# EAGLE design QREx16 (EAGLE 9.4.2)
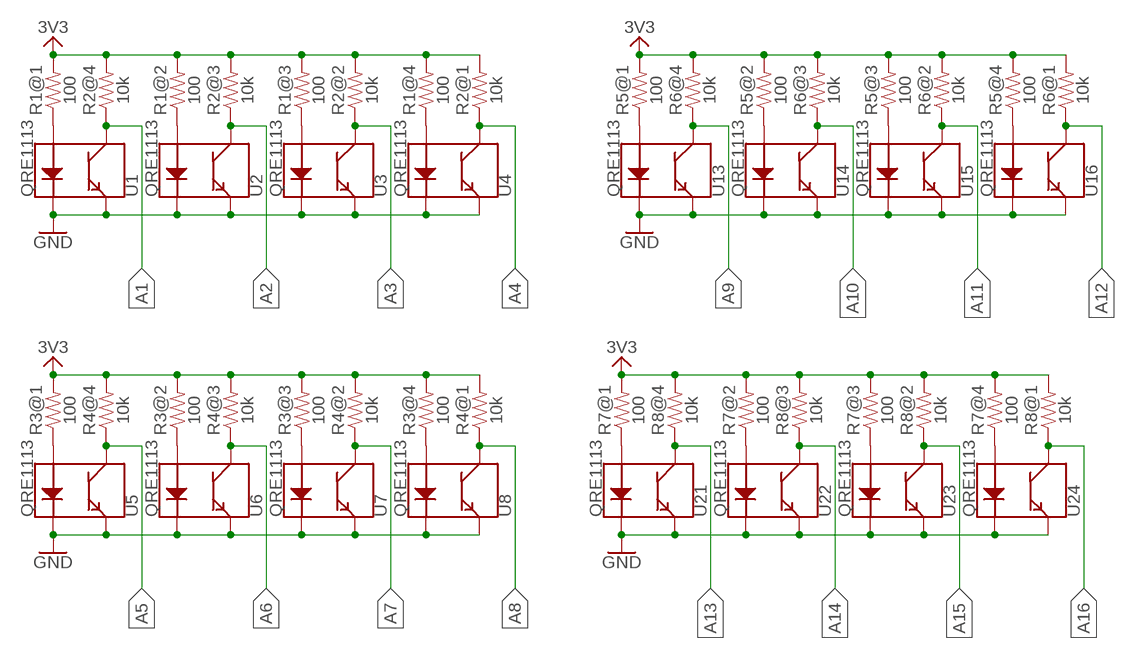
[diagram p0: schematic, sheet 1]

## Parts
R1  100  RESISTOR_ARRAY_1206_SEPARATE  [RESCAF80P320X160X60-8N]
R2  10k  RESISTOR_ARRAY_1206_SEPARATE  [RESCAF80P320X160X60-8N]
R3  100  RESISTOR_ARRAY_1206_SEPARATE  [RESCAF80P320X160X60-8N]
R4  10k  RESISTOR_ARRAY_1206_SEPARATE  [RESCAF80P320X160X60-8N]
R5  100  RESISTOR_ARRAY_1206_SEPARATE  [RESCAF80P320X160X60-8N]
R6  10k  RESISTOR_ARRAY_1206_SEPARATE  [RESCAF80P320X160X60-8N]
R7  100  RESISTOR_ARRAY_1206_SEPARATE  [RESCAF80P320X160X60-8N]
R8  10k  RESISTOR_ARRAY_1206_SEPARATE  [RESCAF80P320X160X60-8N]
U1  QRE1113  QRE1113SMD-W  [QRE1113-W]
U2  QRE1113  QRE1113SMD-W  [QRE1113-W]
U3  QRE1113  QRE1113SMD-W  [QRE1113-W]
U4  QRE1113  QRE1113SMD-W  [QRE1113-W]
U5  QRE1113  QRE1113SMD-W  [QRE1113-W]
U6  QRE1113  QRE1113SMD-W  [QRE1113-W]
U7  QRE1113  QRE1113SMD-W  [QRE1113-W]
U8  QRE1113  QRE1113SMD-W  [QRE1113-W]
U13  QRE1113  QRE1113SMD-W  [QRE1113-W]
U14  QRE1113  QRE1113SMD-W  [QRE1113-W]
U15  QRE1113  QRE1113SMD-W  [QRE1113-W]
U16  QRE1113  QRE1113SMD-W  [QRE1113-W]
U21  QRE1113  QRE1113SMD-W  [QRE1113-W]
U22  QRE1113  QRE1113SMD-W  [QRE1113-W]
U23  QRE1113  QRE1113SMD-W  [QRE1113-W]
U24  QRE1113  QRE1113SMD-W  [QRE1113-W]

## Nets
3.3V: R1.5 R1.6 R1.7 R1.8 R2.5 R2.6 R2.7 R2.8 R3.5 R3.6 R3.7 R3.8 R4.5 R4.6 R4.7 R4.8 R5.5 R5.6 R5.7 R5.8 R6.5 R6.6 R6.7 R6.8 R7.5 R7.6 R7.7 R7.8 R8.5 R8.6 R8.7 R8.8 ; supply symbol labelled SUPPLY_3.3V
A1: R2.4 U1.3(C)
A2: R2.3 U2.3(C)
A3: R2.2 U3.3(C)
A4: R2.1 U4.3(C)
A5: R4.4 U5.3(C)
A6: R4.3 U6.3(C)
A7: R4.2 U7.3(C)
A8: R4.1 U8.3(C)
A9: R6.4 U13.3(C)
A10: R6.3 U14.3(C)
A11: R6.2 U15.3(C)
A12: R6.1 U16.3(C)
A13: R8.4 U21.3(C)
A14: R8.3 U22.3(C)
A15: R8.2 U23.3(C)
A16: R8.1 U24.3(C)
GND: U1.2(K) U1.4(E) U2.2(K) U2.4(E) U3.2(K) U3.4(E) U4.2(K) U4.4(E) U5.2(K) U5.4(E) U6.2(K) U6.4(E) U7.2(K) U7.4(E) U8.2(K) U8.4(E) U13.2(K) U13.4(E) U14.2(K) U14.4(E) U15.2(K) U15.4(E) U16.2(K) U16.4(E) U21.2(K) U21.4(E) U22.2(K) U22.4(E) U23.2(K) U23.4(E) U24.2(K) U24.4(E) ; supply symbol labelled SUPPLY_GND
N$5: R1.1 U1.1(A)
N$6: R1.2 U2.1(A)
N$7: R1.3 U3.1(A)
N$8: R1.4 U4.1(A)
N$9: R3.1 U5.1(A)
N$10: R3.2 U6.1(A)
N$11: R3.3 U7.1(A)
N$12: R3.4 U8.1(A)
N$13: R5.1 U13.1(A)
N$14: R5.2 U14.1(A)
N$15: R5.3 U15.1(A)
N$16: R5.4 U16.1(A)
N$21: R7.1 U21.1(A)
N$22: R7.2 U22.1(A)
N$23: R7.3 U23.1(A)
N$24: R7.4 U24.1(A)

## Library data of the parts
R1-R8 = Scott-Electrical:RESISTOR_ARRAY_1206_SEPARATE
U1-U8 U13-U16 U21-U24 = Scott-Sensors:QRE1113: QRE1113 Reflective Object Sensor The QRE1113 is a small IR reflectance sensor. This sensor is often used in line following robots because, if it can sense if a surface is white or black. There are four pins on the QRE1113 - two control the IR emitting LED while the other two are the collector and emitter of a phototransistor. The IR diode has a max forward current of 50mA and operates at 940nm. Datasheet <http://www.sparkfun.com/datasheets/Components/SMD/QRE1113.GR.pdf> SparkFun Products IR Reflectance Sensor - QRE1113 <https://www.sparkfun.com/products/9542> (COM-09542) SparkFun Line Sensor Breakout - QRE1113 (Analog) <https://www.sparkfun.com/products/9453> (ROB-09453) SparkFun Line Sensor Breakout - QRE1113 (Digital) <https://www.sparkfun.com/products/9454> (ROB-09454) SparkFun RedBot Sensor - Line Follower <https://www.sparkfun.com/products/11769> (SEN-11769) SparkFun RedBot Sensor - Wheel Encoder <https://www.sparkfun.com/products/12617> (SEN-12617) SparkFun Line Follower Array <https://www.sparkfun.com/products/13582> (SEN-13582); PROD_ID: IC-09357; SF_ID: COM-09542

## Board
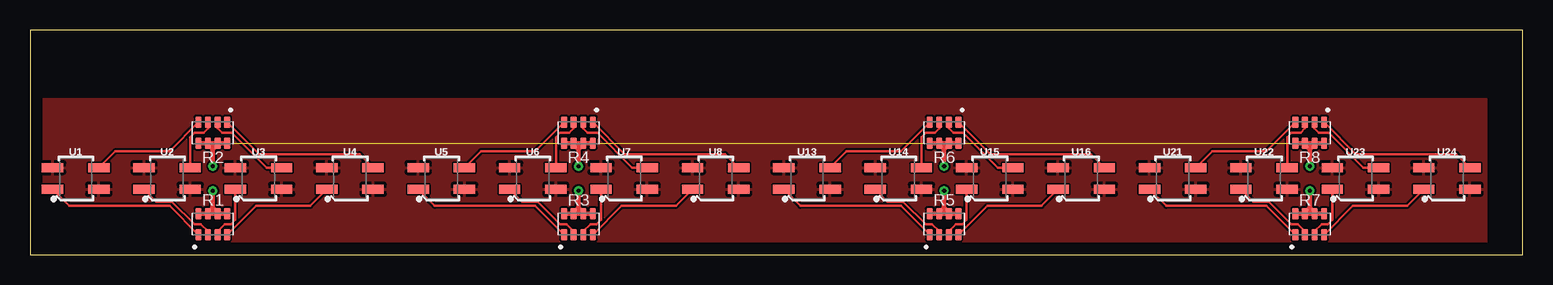
[diagram p1: board, top side]
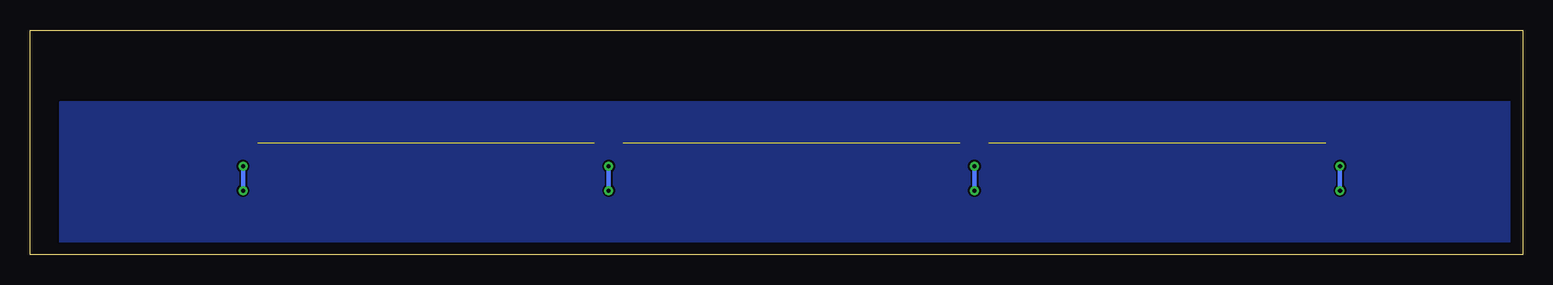
[diagram p2: board, bottom side, seen from below]

Size 124.44 x 18.72 mm. Coordinates in mm from the lower left corner, seen from the top.
Outline: 0,0 124.44,0 124.44,18.72 0,18.72 0,0
Copper layers (1*16): Top 0.035mm / dielectric 0.15mm / Bottom 0.035mm
Design rules "default": minimum track width 6mil, minimum drill 0.35mm, track to track 6mil, track to pad 6mil, pad to pad 6mil, via to via 6mil, smd to smd 6mil, copper to edge 40mil, drill to drill 6mil, minimum pad ring 10mil, minimum via ring 8mil, stop-mask expansion 4mil, vias tented up to drill 0mil, thermal gap 10mil

### Footprints (pad centres in the part's own frame; a part is rotated, then mirrored left to right if it is on the bottom)
RESCAF80P320X160X60-8N = smd 0.97 x 0.53: 1 -0.875,1.2; 2 -0.875,0.4; 3 -0.875,-0.4; 4 -0.875,-1.2; 5 0.875,-1.2; 6 0.875,-0.4; 7 0.875,0.4; 8 0.875,1.2
QRE1113-W = smd 1.778 x 0.762: 1 -1.927,-0.9; 2 1.927,-0.9; 3 1.927,0.9; 4 -1.927,0.9

### Placement (x,y rotation side)
R1  15.24,2.54 90 top
R2  15.24,10.16 270 top
R3  45.72,2.54 90 top
R4  45.72,10.16 270 top
R5  76.2,2.54 90 top
R6  76.2,10.16 270 top
R7  106.68,2.54 90 top
R8  106.68,10.16 270 top
U1  3.81,6.35 0 top
U2  11.43,6.35 0 top
U3  19.05,6.35 0 top
U4  26.67,6.35 0 top
U5  34.29,6.35 0 top
U6  41.91,6.35 0 top
U7  49.53,6.35 0 top
U8  57.15,6.35 0 top
U13  64.77,6.35 0 top
U14  72.39,6.35 0 top
U15  80.01,6.35 0 top
U16  87.63,6.35 0 top
U21  95.25,6.35 0 top
U22  102.87,6.35 0 top
U23  110.49,6.35 0 top
U24  118.11,6.35 0 top

### Tracks (layer width: path | path; a pad name or v marks a point on that pad's centre or on a via)
3.3V  (via drill 0.35)  (3 unrouted)
  Top 0.152: R2.6 14.84,9.04 15.24,8.64 15.64,9.04 R2.7 | R1.7 14.84,3.66 15.24,4.06 15.64,3.66 R1.6 | R4.6 45.32,9.04 45.72,8.64 46.12,9.04 R4.7 | R3.7 45.32,3.66 45.72,4.06 46.12,3.66 R3.6 | R6.6 75.8,9.04 76.2,8.64 76.6,9.04 R6.7 | R5.7 75.8,3.66 76.2,4.06 76.6,3.66 R5.6 | R8.6 106.28,9.04 106.68,8.64 107.08,9.04 R8.7 | R7.7 106.28,3.66 106.68,4.06 107.08,3.66 R7.6
  Top 0.356: R2.5 R2.6 15.24,9.29 | 15.24,9.29 R2.7 R2.8 | R1.5 R1.6 15.24,3.42 | 15.24,3.42 R1.7 R1.8 | 15.24,3.42 15.24,4.06 v15.24,5.33 | 15.24,9.29 15.24,8.64 v15.24,7.37 | R4.5 R4.6 45.72,9.29 | 45.72,9.29 R4.7 R4.8 | R3.5 R3.6 45.72,3.42 | 45.72,3.42 R3.7 R3.8 | 45.72,3.42 45.72,4.06 v45.72,5.33 | 45.72,9.29 45.72,8.64 v45.72,7.37 | R6.5 R6.6 76.2,9.29 | 76.2,9.29 R6.7 R6.8 | R5.5 R5.6 76.2,3.42 | 76.2,3.42 R5.7 R5.8 | 76.2,3.42 76.2,4.06 v76.2,5.33 | 76.2,9.29 76.2,8.64 v76.2,7.37 | R8.5 R8.6 106.68,9.29 | 106.68,9.29 R8.7 R8.8 | R7.5 R7.6 106.68,3.42 | 106.68,3.42 R7.7 R7.8 | 106.68,3.42 106.68,4.06 v106.68,5.33 | 106.68,9.29 106.68,8.64 v106.68,7.37
  Bottom 0.356: v15.24,7.37 15.24,6.35 v15.24,5.33 | v45.72,7.37 v45.72,5.33 | v76.2,7.37 v76.2,5.33 | v106.68,7.37 v106.68,5.33
3V3
  pour Bottom: 0,12.7 121.92,12.7 121.92,0 0,0
A1
  Top 0.203: R2.4 11.64,8.64 7.12,8.64 U1.3
A2
  Top 0.203: R2.3 14.84,10.52 14.48,10.16 13.72,10.16 13.36,9.8 U2.3
A3
  Top 0.203: R2.2 15.64,10.52 16,10.16 16.81,10.16 19.72,7.25 U3.3
A4
  Top 0.203: R2.1 19.09,8.38 27.46,8.38 U4.3
A5
  Top 0.203: R4.4 42.12,8.64 37.6,8.64 U5.3
A6
  Top 0.203: R4.3 45.32,10.52 44.96,10.16 44.2,10.16 43.84,9.8 U6.3
A7
  Top 0.203: R4.2 46.12,10.52 46.48,10.16 47.29,10.16 50.2,7.25 U7.3
A8
  Top 0.203: R4.1 49.57,8.38 57.95,8.38 U8.3
A9
  Top 0.203: R6.4 72.6,8.64 68.08,8.64 U13.3
A10
  Top 0.203: R6.3 75.8,10.52 75.44,10.16 74.68,10.16 74.32,9.8 U14.3
A11
  Top 0.203: R6.2 76.6,10.52 76.96,10.16 77.77,10.16 80.68,7.25 U15.3
A12
  Top 0.203: R6.1 80.05,8.38 88.42,8.38 U16.3
A13
  Top 0.203: R8.4 103.08,8.64 98.56,8.64 U21.3
A14
  Top 0.203: R8.3 106.28,10.52 105.92,10.16 105.16,10.16 104.8,9.8 U22.3
A15
  Top 0.203: R8.2 107.08,10.52 107.44,10.16 108.25,10.16 111.16,7.25 U23.3
A16
  Top 0.203: R8.1 110.53,8.38 118.91,8.38 U24.3
GND
  pour Top: 0.51,12.95 29.97,12.95 29.97,0.25 0.51,0.25
  pour Top: 29.72,12.95 60.45,12.95 60.45,0.25 29.72,0.25
  pour Top: 58.93,12.95 90.93,12.95 90.93,0.25 58.93,0.25
  pour Top: 89.41,12.95 121.41,12.95 121.41,0.25 89.41,0.25
N$5
  Top 0.203: R1.1 11.64,4.06 3.27,4.06 U1.1
N$6
  Top 0.203: R1.2 14.84,1.94 14.23,2.54 13.71,2.54 11.83,4.42 10.53,4.42 U2.1
N$7
  Top 0.203: U3.1 17.12,2.9 16.76,2.54 16.25,2.54 15.64,1.94 R1.3
N$8
  Top 0.203: R1.4 18.84,4.06 23.37,4.06 U4.1
N$9
  Top 0.203: R3.1 42.12,4.06 33.75,4.06 U5.1
N$10
  Top 0.203: R3.2 45.32,1.94 44.72,2.54 44.19,2.54 42.31,4.42 41.01,4.42 U6.1
N$11
  Top 0.203: U7.1 47.6,2.9 47.24,2.54 46.73,2.54 46.12,1.94 R3.3
N$12
  Top 0.203: R3.4 49.32,4.06 53.85,4.06 U8.1
N$13
  Top 0.203: R5.1 72.6,4.06 64.23,4.06 U13.1
N$14
  Top 0.203: R5.2 75.8,1.94 75.19,2.54 74.67,2.54 72.79,4.42 71.49,4.42 U14.1
N$15
  Top 0.203: U15.1 78.08,2.9 77.72,2.54 77.2,2.54 76.6,1.94 R5.3
N$16
  Top 0.203: R5.4 79.8,4.06 84.33,4.06 U16.1
N$21
  Top 0.203: R7.1 103.08,4.06 94.71,4.06 U21.1
N$22
  Top 0.203: R7.2 106.28,1.94 105.67,2.54 105.15,2.54 103.27,4.42 101.97,4.42 U22.1
N$23
  Top 0.203: U23.1 108.56,2.9 108.2,2.54 107.69,2.54 107.08,1.94 R7.3
N$24
  Top 0.203: R7.4 110.28,4.06 114.81,4.06 U24.1